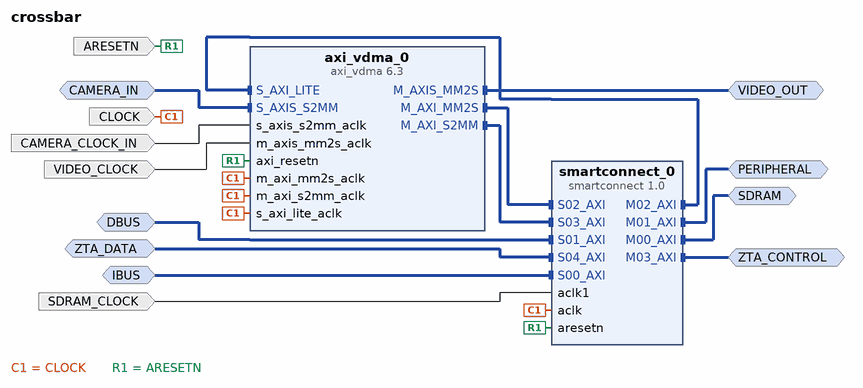
[diagram p0: block diagram of the top level]
# Vivado block design crossbar, xc7a100tcsg324-1, Vivado 2020.2
create_bd_design crossbar

create_bd_intf_port -mode Slave -vlnv xilinx.com:interface:aximm_rtl:1.0 IBUS
set_property -dict [list \
  CONFIG.ADDR_WIDTH 32 \
  CONFIG.ARUSER_WIDTH 0 \
  CONFIG.AWUSER_WIDTH 0 \
  CONFIG.BUSER_WIDTH 0 \
  CONFIG.DATA_WIDTH 32 \
  CONFIG.FREQ_HZ 125000000 \
  CONFIG.HAS_BRESP 1 \
  CONFIG.HAS_BURST 1 \
  CONFIG.HAS_CACHE 1 \
  CONFIG.HAS_LOCK 1 \
  CONFIG.HAS_PROT 1 \
  CONFIG.HAS_QOS 1 \
  CONFIG.HAS_REGION 1 \
  CONFIG.HAS_RRESP 1 \
  CONFIG.HAS_WSTRB 1 \
  CONFIG.ID_WIDTH 1 \
  CONFIG.MAX_BURST_LENGTH 16 \
  CONFIG.NUM_READ_OUTSTANDING 64 \
  CONFIG.NUM_READ_THREADS 1 \
  CONFIG.NUM_WRITE_OUTSTANDING 64 \
  CONFIG.NUM_WRITE_THREADS 1 \
  CONFIG.PROTOCOL AXI4 \
  CONFIG.READ_WRITE_MODE READ_ONLY \
  CONFIG.RUSER_BITS_PER_BYTE 0 \
  CONFIG.RUSER_WIDTH 0 \
  CONFIG.SUPPORTS_NARROW_BURST 1 \
  CONFIG.WUSER_BITS_PER_BYTE 0 \
  CONFIG.WUSER_WIDTH 0 \
] [get_bd_intf_ports IBUS]
create_bd_intf_port -mode Slave -vlnv xilinx.com:interface:aximm_rtl:1.0 DBUS
set_property -dict [list \
  CONFIG.ADDR_WIDTH 32 \
  CONFIG.ARUSER_WIDTH 0 \
  CONFIG.AWUSER_WIDTH 0 \
  CONFIG.BUSER_WIDTH 0 \
  CONFIG.DATA_WIDTH 32 \
  CONFIG.FREQ_HZ 125000000 \
  CONFIG.HAS_BRESP 1 \
  CONFIG.HAS_BURST 1 \
  CONFIG.HAS_CACHE 1 \
  CONFIG.HAS_LOCK 1 \
  CONFIG.HAS_PROT 1 \
  CONFIG.HAS_QOS 1 \
  CONFIG.HAS_REGION 1 \
  CONFIG.HAS_RRESP 1 \
  CONFIG.HAS_WSTRB 1 \
  CONFIG.ID_WIDTH 1 \
  CONFIG.MAX_BURST_LENGTH 16 \
  CONFIG.NUM_READ_OUTSTANDING 64 \
  CONFIG.NUM_READ_THREADS 1 \
  CONFIG.NUM_WRITE_OUTSTANDING 64 \
  CONFIG.NUM_WRITE_THREADS 1 \
  CONFIG.PROTOCOL AXI4 \
  CONFIG.READ_WRITE_MODE READ_WRITE \
  CONFIG.RUSER_BITS_PER_BYTE 0 \
  CONFIG.RUSER_WIDTH 0 \
  CONFIG.SUPPORTS_NARROW_BURST 1 \
  CONFIG.WUSER_BITS_PER_BYTE 0 \
  CONFIG.WUSER_WIDTH 0 \
] [get_bd_intf_ports DBUS]
create_bd_intf_port -mode Slave -vlnv xilinx.com:interface:aximm_rtl:1.0 ZTA_DATA
set_property -dict [list \
  CONFIG.ADDR_WIDTH 32 \
  CONFIG.ARUSER_WIDTH 0 \
  CONFIG.AWUSER_WIDTH 0 \
  CONFIG.BUSER_WIDTH 0 \
  CONFIG.DATA_WIDTH 64 \
  CONFIG.FREQ_HZ 125000000 \
  CONFIG.HAS_BRESP 1 \
  CONFIG.HAS_BURST 1 \
  CONFIG.HAS_CACHE 1 \
  CONFIG.HAS_LOCK 1 \
  CONFIG.HAS_PROT 1 \
  CONFIG.HAS_QOS 1 \
  CONFIG.HAS_REGION 1 \
  CONFIG.HAS_RRESP 1 \
  CONFIG.HAS_WSTRB 1 \
  CONFIG.ID_WIDTH 1 \
  CONFIG.MAX_BURST_LENGTH 256 \
  CONFIG.NUM_READ_OUTSTANDING 64 \
  CONFIG.NUM_READ_THREADS 1 \
  CONFIG.NUM_WRITE_OUTSTANDING 64 \
  CONFIG.NUM_WRITE_THREADS 1 \
  CONFIG.PROTOCOL AXI4 \
  CONFIG.READ_WRITE_MODE READ_WRITE \
  CONFIG.RUSER_BITS_PER_BYTE 0 \
  CONFIG.RUSER_WIDTH 0 \
  CONFIG.SUPPORTS_NARROW_BURST 1 \
  CONFIG.WUSER_BITS_PER_BYTE 0 \
  CONFIG.WUSER_WIDTH 0 \
] [get_bd_intf_ports ZTA_DATA]
create_bd_intf_port -mode Slave -vlnv xilinx.com:interface:axis_rtl:1.0 CAMERA_IN
set_property -dict [list \
  CONFIG.FREQ_HZ 25000000 \
  CONFIG.HAS_TKEEP 0 \
  CONFIG.HAS_TLAST 1 \
  CONFIG.HAS_TREADY 1 \
  CONFIG.HAS_TSTRB 0 \
  CONFIG.LAYERED_METADATA undef \
  CONFIG.TDATA_NUM_BYTES 4 \
  CONFIG.TDEST_WIDTH 0 \
  CONFIG.TID_WIDTH 0 \
  CONFIG.TUSER_WIDTH 0 \
] [get_bd_intf_ports CAMERA_IN]
create_bd_intf_port -mode Master -vlnv xilinx.com:interface:aximm_rtl:1.0 SDRAM
set_property -dict [list \
  CONFIG.ADDR_WIDTH 32 \
  CONFIG.CLK_DOMAIN crossbar_SDRAM_CLOCK \
  CONFIG.DATA_WIDTH 64 \
  CONFIG.FREQ_HZ 166666666 \
  CONFIG.HAS_REGION 0 \
  CONFIG.NUM_READ_OUTSTANDING 64 \
  CONFIG.NUM_WRITE_OUTSTANDING 64 \
  CONFIG.PROTOCOL AXI4 \
] [get_bd_intf_ports SDRAM]
create_bd_intf_port -mode Master -vlnv xilinx.com:interface:aximm_rtl:1.0 ZTA_CONTROL
set_property -dict [list \
  CONFIG.ADDR_WIDTH 32 \
  CONFIG.DATA_WIDTH 32 \
  CONFIG.FREQ_HZ 125000000 \
  CONFIG.HAS_REGION 0 \
  CONFIG.NUM_READ_OUTSTANDING 64 \
  CONFIG.NUM_WRITE_OUTSTANDING 64 \
  CONFIG.PROTOCOL AXI4 \
] [get_bd_intf_ports ZTA_CONTROL]
create_bd_intf_port -mode Master -vlnv xilinx.com:interface:axis_rtl:1.0 VIDEO_OUT
set_property -dict {CONFIG.FREQ_HZ 25000000} [get_bd_intf_ports VIDEO_OUT]
create_bd_intf_port -mode Master -vlnv xilinx.com:interface:aximm_rtl:1.0 PERIPHERAL
set_property -dict [list \
  CONFIG.ADDR_WIDTH 32 \
  CONFIG.DATA_WIDTH 32 \
  CONFIG.FREQ_HZ 125000000 \
  CONFIG.HAS_REGION 0 \
  CONFIG.HAS_WSTRB 1 \
  CONFIG.NUM_READ_OUTSTANDING 8 \
  CONFIG.NUM_WRITE_OUTSTANDING 8 \
  CONFIG.PROTOCOL AXI4 \
] [get_bd_intf_ports PERIPHERAL]
create_bd_port -dir I -type clk CLOCK
set_property -dict [list \
  CONFIG.ASSOCIATED_BUSIF IBUS:DBUS:ZTA_CONTROL:ZTA_DATA:PERIPHERAL \
  CONFIG.FREQ_HZ 125000000 \
] [get_bd_ports CLOCK]
create_bd_port -dir I -type rst ARESETN
create_bd_port -dir I -type clk VIDEO_CLOCK
set_property -dict {CONFIG.FREQ_HZ 25000000} [get_bd_ports VIDEO_CLOCK]
create_bd_port -dir I -type clk CAMERA_CLOCK_IN
set_property -dict {CONFIG.FREQ_HZ 25000000} [get_bd_ports CAMERA_CLOCK_IN]
create_bd_port -dir I -type clk SDRAM_CLOCK
set_property -dict [list \
  CONFIG.ASSOCIATED_BUSIF SDRAM \
  CONFIG.CLK_DOMAIN crossbar_SDRAM_CLOCK \
  CONFIG.FREQ_HZ 166666666 \
] [get_bd_ports SDRAM_CLOCK]

create_bd_cell -type ip -vlnv xilinx.com:ip:smartconnect:1.0 smartconnect_0
set_property -dict {CONFIG.NUM_CLKS 2 CONFIG.NUM_MI 4 CONFIG.NUM_SI 5} [get_bd_cells smartconnect_0]
create_bd_cell -type ip -vlnv xilinx.com:ip:axi_vdma:6.3 axi_vdma_0
set_property -dict [list \
  CONFIG.c_m_axi_mm2s_data_width 32 \
  CONFIG.c_m_axi_s2mm_data_width 32 \
  CONFIG.c_mm2s_genlock_mode 0 \
  CONFIG.c_mm2s_linebuffer_depth 4096 \
  CONFIG.c_mm2s_max_burst_length 8 \
  CONFIG.c_num_fstores 8 \
  CONFIG.c_s2mm_genlock_mode 0 \
  CONFIG.c_s2mm_linebuffer_depth 512 \
  CONFIG.c_use_s2mm_fsync 0 \
] [get_bd_cells axi_vdma_0]

# ---- connections ----

connect_bd_intf_net [get_bd_intf_ports VIDEO_OUT] [get_bd_intf_pins axi_vdma_0/M_AXIS_MM2S]
connect_bd_intf_net [get_bd_intf_ports ZTA_CONTROL] [get_bd_intf_pins smartconnect_0/M03_AXI]
connect_bd_intf_net [get_bd_intf_ports DBUS] [get_bd_intf_pins smartconnect_0/S01_AXI]
connect_bd_intf_net [get_bd_intf_ports PERIPHERAL] [get_bd_intf_pins smartconnect_0/M01_AXI]
connect_bd_intf_net [get_bd_intf_pins axi_vdma_0/M_AXI_MM2S] [get_bd_intf_pins smartconnect_0/S02_AXI]
connect_bd_intf_net [get_bd_intf_ports ZTA_DATA] [get_bd_intf_pins smartconnect_0/S04_AXI]
connect_bd_intf_net [get_bd_intf_ports IBUS] [get_bd_intf_pins smartconnect_0/S00_AXI]
connect_bd_intf_net [get_bd_intf_ports CAMERA_IN] [get_bd_intf_pins axi_vdma_0/S_AXIS_S2MM]
connect_bd_intf_net [get_bd_intf_pins axi_vdma_0/S_AXI_LITE] [get_bd_intf_pins smartconnect_0/M02_AXI]
connect_bd_intf_net [get_bd_intf_ports SDRAM] [get_bd_intf_pins smartconnect_0/M00_AXI]
connect_bd_intf_net [get_bd_intf_pins axi_vdma_0/M_AXI_S2MM] [get_bd_intf_pins smartconnect_0/S03_AXI]
connect_bd_net [get_bd_ports CLOCK] \
  [get_bd_pins axi_vdma_0/s_axi_lite_aclk] [get_bd_pins axi_vdma_0/m_axi_mm2s_aclk] [get_bd_pins axi_vdma_0/m_axi_s2mm_aclk] \
  [get_bd_pins smartconnect_0/aclk]
connect_bd_net [get_bd_ports CAMERA_CLOCK_IN] [get_bd_pins axi_vdma_0/s_axis_s2mm_aclk]
connect_bd_net [get_bd_ports VIDEO_CLOCK] [get_bd_pins axi_vdma_0/m_axis_mm2s_aclk]
connect_bd_net [get_bd_ports ARESETN] [get_bd_pins axi_vdma_0/axi_resetn] [get_bd_pins smartconnect_0/aresetn]
connect_bd_net [get_bd_ports SDRAM_CLOCK] [get_bd_pins smartconnect_0/aclk1]

# ---- address map ----
assign_bd_address -offset 0x00000000 -range 256M -target_address_space [get_bd_addr_spaces axi_vdma_0/Data_MM2S] [get_bd_addr_segs SDRAM/Reg]
exclude_bd_addr_seg -offset 0xF1000000 -range 64K -target_address_space [get_bd_addr_spaces axi_vdma_0/Data_MM2S] [get_bd_addr_segs axi_vdma_0/S_AXI_LITE/Reg]
exclude_bd_addr_seg -offset 0xF2000000 -range 64K -target_address_space [get_bd_addr_spaces axi_vdma_0/Data_MM2S] [get_bd_addr_segs ZTA_CONTROL/Reg]
exclude_bd_addr_seg -offset 0xF4000000 -range 64K -target_address_space [get_bd_addr_spaces axi_vdma_0/Data_MM2S] [get_bd_addr_segs PERIPHERAL/Reg]
assign_bd_address -offset 0x00000000 -range 256M -target_address_space [get_bd_addr_spaces axi_vdma_0/Data_S2MM] [get_bd_addr_segs SDRAM/Reg]
exclude_bd_addr_seg -offset 0xF1000000 -range 64K -target_address_space [get_bd_addr_spaces axi_vdma_0/Data_S2MM] [get_bd_addr_segs axi_vdma_0/S_AXI_LITE/Reg]
exclude_bd_addr_seg -offset 0xF2000000 -range 64K -target_address_space [get_bd_addr_spaces axi_vdma_0/Data_S2MM] [get_bd_addr_segs ZTA_CONTROL/Reg]
exclude_bd_addr_seg -offset 0xF4000000 -range 64K -target_address_space [get_bd_addr_spaces axi_vdma_0/Data_S2MM] [get_bd_addr_segs PERIPHERAL/Reg]
assign_bd_address -offset 0x00000000 -range 256M -target_address_space [get_bd_addr_spaces DBUS] [get_bd_addr_segs SDRAM/Reg]
assign_bd_address -offset 0xF1000000 -range 64K -target_address_space [get_bd_addr_spaces DBUS] [get_bd_addr_segs axi_vdma_0/S_AXI_LITE/Reg]
assign_bd_address -offset 0xF2000000 -range 64K -target_address_space [get_bd_addr_spaces DBUS] [get_bd_addr_segs ZTA_CONTROL/Reg]
assign_bd_address -offset 0xF4000000 -range 64K -target_address_space [get_bd_addr_spaces DBUS] [get_bd_addr_segs PERIPHERAL/Reg]
assign_bd_address -offset 0x00000000 -range 256M -target_address_space [get_bd_addr_spaces IBUS] [get_bd_addr_segs SDRAM/Reg]
exclude_bd_addr_seg -offset 0xF1000000 -range 64K -target_address_space [get_bd_addr_spaces IBUS] [get_bd_addr_segs axi_vdma_0/S_AXI_LITE/Reg]
exclude_bd_addr_seg -offset 0xF2000000 -range 64K -target_address_space [get_bd_addr_spaces IBUS] [get_bd_addr_segs ZTA_CONTROL/Reg]
exclude_bd_addr_seg -offset 0xF4000000 -range 64K -target_address_space [get_bd_addr_spaces IBUS] [get_bd_addr_segs PERIPHERAL/Reg]
assign_bd_address -offset 0x00000000 -range 256M -target_address_space [get_bd_addr_spaces ZTA_DATA] [get_bd_addr_segs SDRAM/Reg]
exclude_bd_addr_seg -offset 0xF1000000 -range 64K -target_address_space [get_bd_addr_spaces ZTA_DATA] [get_bd_addr_segs axi_vdma_0/S_AXI_LITE/Reg]
exclude_bd_addr_seg -offset 0xF2000000 -range 64K -target_address_space [get_bd_addr_spaces ZTA_DATA] [get_bd_addr_segs ZTA_CONTROL/Reg]
exclude_bd_addr_seg -offset 0xF4000000 -range 64K -target_address_space [get_bd_addr_spaces ZTA_DATA] [get_bd_addr_segs PERIPHERAL/Reg]

validate_bd_design
save_bd_design
